# Altium schematic sheet GNSS Antenna.SchDoc: GNSS Antenna & LNA
size 292 x 193 mm; SheetNumber: 14; SheetTotal: 15
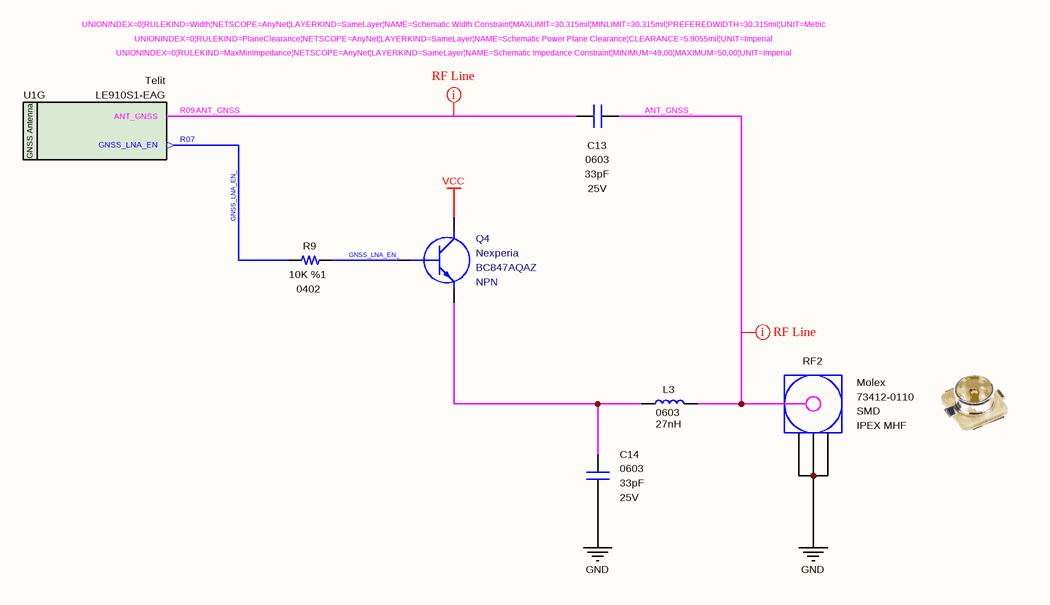
[diagram p0: GNSS Antenna.SchDoc]

## Parts
C13  value 33pF  Case: 0603  Voltage: 25V  [CAPACITOR_0603]
C14  value 33pF  Case: 0603  Voltage: 25V  [CAPACITOR_0603]
L3  value 27nH  Case: 0603  [INDUCTOR_0603]
Q4  Manufacturer Name: Nexperia  Manufacturer Part Number: BC847AQAZ  Polarity: NPN  [SOT1215]
R9  value 10K  Case: 0402  Tolerance: %1  [RESISTOR_0402]
RF2  Connector Type: IPEX MHF  Case: SMD  Manufacturer Part Number: 73412-0110  Manufacturer Name: Molex  [Connector_IPEX]
U1  Manufacturer Part Number: LE910S1-EAG  Manufacturer Name: Telit  [LE910 GSM Modem]  (hidden comment: LE910S1-EAG LTE GSM Module)  (part G of 19)

## Nets
GND: C14.1 RF2.2(GND) RF2.3(GND) RF2.4(GND)
VCC: Q4.3(C)
ANT_GNSS: C13.2 U1.R09(ANT_GNSS)
ANT_GNSS_: C13.1 L3.2 RF2.1(Signal)
GNSS_LNA_EN_: Q4.1(B) R9.1 R9.2 U1.R07(GNSS_LNA_EN)
NetC14_2: C14.2 L3.1 Q4.2(E)

## Layout directives
rule Impedance Constraint [Min = 49.00    Max = 50.00    ]; rule Power Plane Clearance [Clearance = 5.906mil]; rule Width Constraint [Pref Width = 0.77mm    Min Width = 0.77mm    Max Width = 0.77mm]: ANT_GNSS, ANT_GNSS_

## Notes on the sheet
- © 2021 All rights reserved.
  This document may not, in whole or in part, be copied, photocopied, reproduced, translated or converted to any electronic or machine readable from without prior written permission of Mehmet Günce Akkoyun.
  Engineer contact : akkoyun@me.com
- Property of
- Engineer :
- Date :
- Size :
- A4
- Time :
- Project :
- Page :
- /
- Customer :
- Product ID :
- Module ID :
- Version :
- File :
- Revision :
- (in symbol IC - LE910S1-EAG, part G) GNSS Antenna

## Library data of the parts
C13 C14 = 33pF [0603-25V]: Capacitor - 33pF [0603] (Ceramic); Manufacturer Name: Kyocera AVX; Manufacturer Part Number: 06033A330F4T2A; Dielectric: C0G; Tolerance: 1%; Height: 0.9mm; Maximum Operating Temperature: +125; Minimum Operating Temperature: -55; ROHS: Yes; ComponentLink1Description: DataSheet; ComponentLink1URL: https://api.kemet.com/component-edge/download/datasheet/C0402C330J9RACAUTO.pdf; ComponentLink2Description: Mouser; ComponentLink2URL: https://www.mouser.com/Search/Refine.aspx?Keyword=80-C0402C330J9RAUTO
L3 = 27nH [0603]: Fixed Inductor; Manufacturer Name: Murata Electronics; Manufacturer Part Number: LQW18AN27NJ00D; Tolerance: 5%; Height: 0.8mm; ComponentLink1Description: DataSheet; ComponentLink1URL: https://www.mouser.com.tr/datasheet/2/281/JELF243B-0009-1699631.pdf
Q4 = BC847: Bipolar NPN Transistors; Case: DFN-1010D-3
R9 = 10K: Thick Film Resistors - SMD 1/16 W 10 Kohms 1%; Manufacturer Name: Vishay; Manufacturer Part Number: CRCW040210K0FKED; Height: 0.4mm; ComponentLink1Description: DataSheet; ComponentLink1URL: https://www.mouser.com.tr/datasheet/2/427/dcrcwe3-1762152.pdf; ComponentLink2Description: Mouser; ComponentLink2URL: https://www.mouser.com.tr/ProductDetail/Vishay-Dale/CRCW040210K0FKED?qs=sGAEpiMZZMu61qfTUdNhG2DpbjADlD3GcalbOv9utCY%3D
RF2 = IPEX MHF Connector: MOLEX   73412-0110   RF COAXIAL, MICROCOAXIAL, JACK, 50OHM; ROHS: Yes; Product Type: RF Connectors; Impedance: 50 Ohm; System: Connector
U1 = IC - LE910S1-EAG: Telit LE910S1-EAG GPRS/GNSS Module; Case: BGA